# Altium project Adaptateur _J-Link.PrjPcb
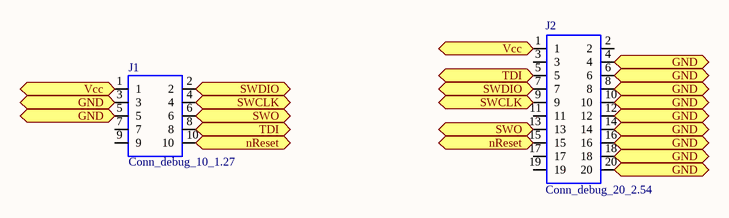
[diagram p0: adaptateur.SchDoc]
1 sheet, 2 parts. Net scope: flat (ports and power ports of the same name join across sheets).
Board file: Adaptateur _J-Link.PcbDoc

## Sheet adaptateur.SchDoc
size A4

### Parts
J1  Conn_debug_10_1.27  [FTSH-105-01-F-DV-K]
J2  Conn_debug_20_2.54  [PCBComponent_1]

### Ports
GND, nReset, SWCLK, SWDIO, SWO, TDI, Vcc

### Nets
NetJ1_1: J1.1 J2.1 ; port Vcc
NetJ1_2: J1.2 J2.7 ; port SWDIO
NetJ1_3: J1.3 J1.5 J2.4 J2.6 J2.8 J2.10 J2.12 J2.14 J2.16 J2.18 J2.20 ; port GND
NetJ1_4: J1.4 J2.9 ; port SWCLK
NetJ1_6: J1.6 J2.13 ; port SWO
NetJ1_8: J1.8 J2.5 ; port TDI
NetJ1_10: J1.10 J2.15 ; port nReset

Not connected (* = marked no-connect by the designer): J1 7 9; J2 2 3 11 17 19

### Notes on the sheet
- Title
- Size:
- Date:
- A4
- Author:
- Time:
- Revision:
- Sheet
- of
- File: